# Altium schematic sheet 12_to_24V_boost_tps5534.SchDoc
size A4; SheetNumber: 1; SheetTotal: 1
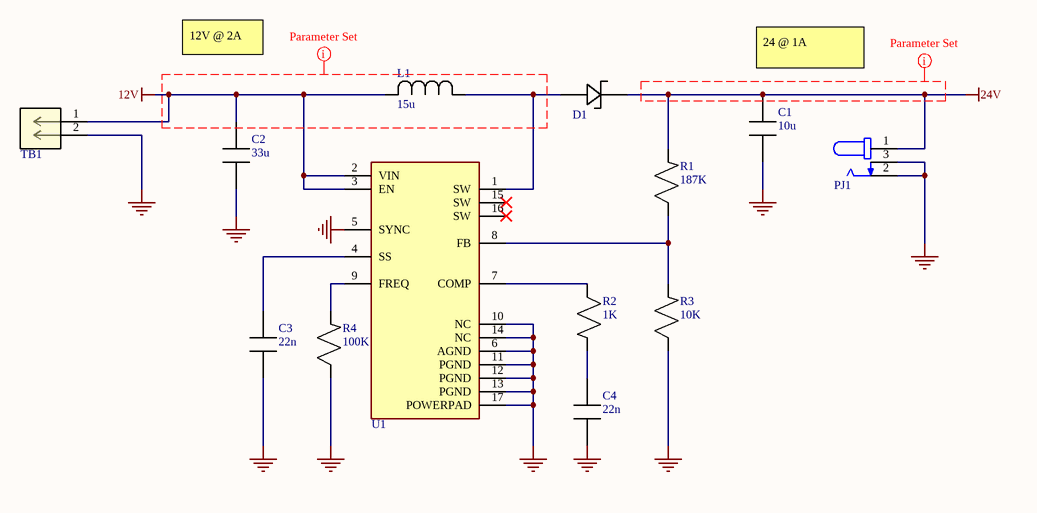
[diagram p0: 12_to_24V_boost_tps5534.SchDoc]

## Parts
C1  10u  [CAP_0603]
C2  33u  [CAP_0805]
C3  value 22n  [CAP_0603]  (hidden comment: 22nF)
C4  value 22n  [CAP_0603]  (hidden comment: 22nF)
D1  SS3P4-M3/84A  [DO-220AA(POWER DIODE)]  (value not drawn)
L1  value 15u  [L_0603]  (hidden comment: IND 15UH 2MA 1.5 OHM)
PJ1  CONN PWR JACK 2.5X5.5MM SOLDER  [PWR_JACK_2.50mm]  (value not drawn)
R1  187K  [RES_0603]
R2  1K  [RES_0603]
R3  10K  [RES_0603]
R4  100K  [RES_0603]
TB1  TERM BLK 2P SIDE ENT 5.08MM PCB  [TB_2x1_5.08mm]  (value not drawn)
U1  TPS55340RTER  [WQFN-16_3X3MM]  (value not drawn)

## Nets
12V: C2.2 L1.1 TB1.1 U1.2(VIN) U1.3(EN)
24V: C1.2 D1.2 PJ1.1 R1.2
GND: C1.1 C2.1 C3.1 C4.1 PJ1.2 PJ1.3 R3.1 R4.1 TB1.2 U1.5(SYNC) U1.6(AGND) U1.10(NC) U1.11(PGND) U1.12(PGND) U1.13(PGND) U1.14(NC) U1.17(POWERPAD)
NetC3_2: C3.2 U1.4(SS)
NetC4_2: C4.2 R2.2
NetD1_1: D1.1 L1.2 U1.1(SW)
NetR1_1: R1.1 R3.2 U1.8(FB)
NetR2_1: R2.1 U1.7(COMP)
NetR4_2: R4.2 U1.9(FREQ)

Not connected (* = marked no-connect by the designer): U1 15(SW)* 16(SW)*

## Layout directives
net class 12VCLASS: (no net found under the mark)
net class 24V_CLASS: (no net found under the mark)

## Notes on the sheet
- 12V @ 2A
- (near C1) 24 @ 1A

## Library data of the parts
C1 = CAP_10u_0603: CAP CER 10UF 10V X5R 0603; Manufacturer: Samsung Electro-Mechanics; Manufacturer Part Number 1: CL10A106KP8NNNC; ComponentLink1Description: New link; ComponentLink1URL: https://www.digikey.com/en/products/detail/samsung-electro-mechanics/CL10A106KP8NNNC/3886850; Supplier 1: Digikey; Supplier Part Number 1: 1276-1192-1-ND; Value: 10u
C2 = CAP_33u_0805: CAP CER 33UF 6.3V X5R 0805; Manufacturer: TDK Corporation; Manufacturer Part Number 1: C2012X5R0J336M125AC; ComponentLink1Description: New link; ComponentLink1URL: https://www.digikey.com/en/products/detail/samsung-electro-mechanics/CL10A106KP8NNNC/3886850; Supplier 1: Digikey; Supplier Part Number 1: 445-5986-1-ND; Value: 33u
C3 C4 = CAP_22nF_0603: CAP CER 0.027UF 25V X7R 0603; Manufacturer: Cal-Chip Electronics, Inc.; Manufacturer Part Number 1: GMC10X7R273J25NT; ComponentLink1Description: New link; ComponentLink1URL: https://www.digikey.com/en/products/detail/cal-chip-electronics-inc/GMC10X7R273J25NT/13908236; Supplier 1: Digikey; Supplier Part Number 1: 2571-GMC10X7R273J25NTTR-ND
D1 = SS3P4-M3/84A: DIODE SCHOTTKY 40V 3A DO220AA; Manufacturer: Vishay General Semiconductor - Diodes Division; Manufacturer Part Number 1: SS3P4-M3/84A; ComponentLink1Description: New link; ComponentLink1URL: https://www.digikey.com/en/products/detail/vishay-general-semiconductor-diodes-division/SS3P4-M3-84A/1147819?s=N4IgTCBcDaIMpwMwAUAsBaAsog9ADlQEEQBdAXyA; Supplier 1: Digikey; Supplier Part Number 1: SS3P4-M3/84AGICT-ND
L1 = L_15uH_0603: FIXED IND 15UH 2MA 1.5 OHM SMD; Manufacturer: TDK Corporation; Manufacturer Part Number 1: MLF1608C150KTA00; ComponentLink1Description: New link; ComponentLink1URL: https://www.digikey.com/en/products/detail/tdk-corporation/MLF1608C150KTA00/504196; Supplier Part Number 1: 445-1027-1-ND; Supplier 1: Digi-key
PJ1 = PWR_JACK_2.50mm: Power Barrel Connector Jack 2.50mm ID (0.098"), 5.50mm OD (0.217") Through Hole, Right Angle; Manufacturer: Same Sky (Formerly CUI Devices); Manufacturer Part Number 1: PJ-002B; ComponentLink1Description: New link; ComponentLink1URL: https://www.digikey.com/en/products/detail/same-sky-formerly-cui-devices/PJ-002B/96965; Supplier 1: Digikey; Supplier Part Number 1: CP-002B-ND
R1 = RES_187K_0603: RES SMD 187K OHM 1% 1/10W 0603; Manufacturer: Panasonic Electronic Components; Manufacturer Part Number 1: ERJ-3EKF1873V; ComponentLink1Description: New link; ComponentLink1URL: https://www.digikey.com/en/products/detail/panasonic-electronic-components/ERJ-3EKF1873V/196173; Supplier Part Number 1: P187KHTR-ND; Supplier 1: Digi-key; Value: 187K
R2 = RES_1K_0603: RES 1K OHM 1% 1/10W 0603; Manufacturer: Stackpole Electronics Inc; Manufacturer Part Number 1: RMCF0603FT1K00; Supplier 1: Digi-key; Supplier Part Number 1: RMCF0603FT1K00CT-ND; ComponentLink1Description: New link; ComponentLink1URL: https://www.digikey.com/en/products/detail/stackpole-electronics-inc/RMCF0603FT1K00/1761077; Value: 1K
R3 = RES_10K_0603: RES 10K OHM 1% 1/10W 0603; Manufacturer: Stackpole Electronics Inc; Manufacturer Part Number 1: RMCF0603FT100R; ComponentLink1Description: New link; ComponentLink1URL: https://www.digikey.com/en/products/detail/stackpole-electronics-inc/RMCF0603FT10K0/1761235; Supplier Part Number 1: RMCF0603FT10K0CT-ND; Supplier 1: Digi-key; Value: 10K
R4 = RES_100K_0603: Fixed Resistor, Metal Glaze/thick Film, 0.1W, 100000ohm, 50V, 5% +/-Tol, 200ppm/Cel, Surface Mount, 0603; Manufacturer: Stackpole Electronics Inc; Manufacturer Part Number 1: RMCF0603FT100R; ComponentLink1Description: New link; ComponentLink1URL: https://www.digikey.com/en/products/detail/stackpole-electronics-inc/RMCF0603FT10K0/1761235; Supplier Part Number 1: RMCF0603FT10K0CT-ND; Supplier 1: Digi-key; Case/Package: 0603; Value: 100K
TB1 = TB_2x1_5.08mm: 2 Bloques de terminales - Cable a placa Horizontal con placa 0.200" (5.08mm) Orificio pasante; Manufacturer: Weidmüller; Manufacturer Part Number 1: 1760510000; Supplier 1: Digi-key; Supplier Part Number 1: 281-1882-ND; ComponentLink1Description: New link; ComponentLink1URL: https://www.digikey.com/es/products/detail/weidm%C3%BCller/1760510000/459739
U1 = TPS55340RTER: IC REG BOOST ADJ 5.25A 16WQFN; Manufacturer: Texas Instruments; Supplier 1: Digi-key; Supplier Part Number 1: 296-37677-2-ND; Manufacturer Part Number 1: TPS55340RTER; ComponentLink1Description: New link; ComponentLink1URL: https://www.digikey.com/en/products/detail/texas-instruments/TPS55340RTER/3503781?s=N4IgTCBcDaIC4AcDOBWFBmALABgE5wFNcQBdAXyA